# Altium schematic sheet 03_POWER.SchDoc: =TitleParameter
size A3; SPICEModelCacheDAYWLYRY: <root> / <DocumentId>DAYWLYRY</DocumentId> / </root>; Organization: ASISGUARD; Address1: Kemalpasa, Kemalpasa Cd. No:290 D:292H, 35060 Bornova/Izmir/Turkey; SheetNumber: 3; SheetTotal: 12
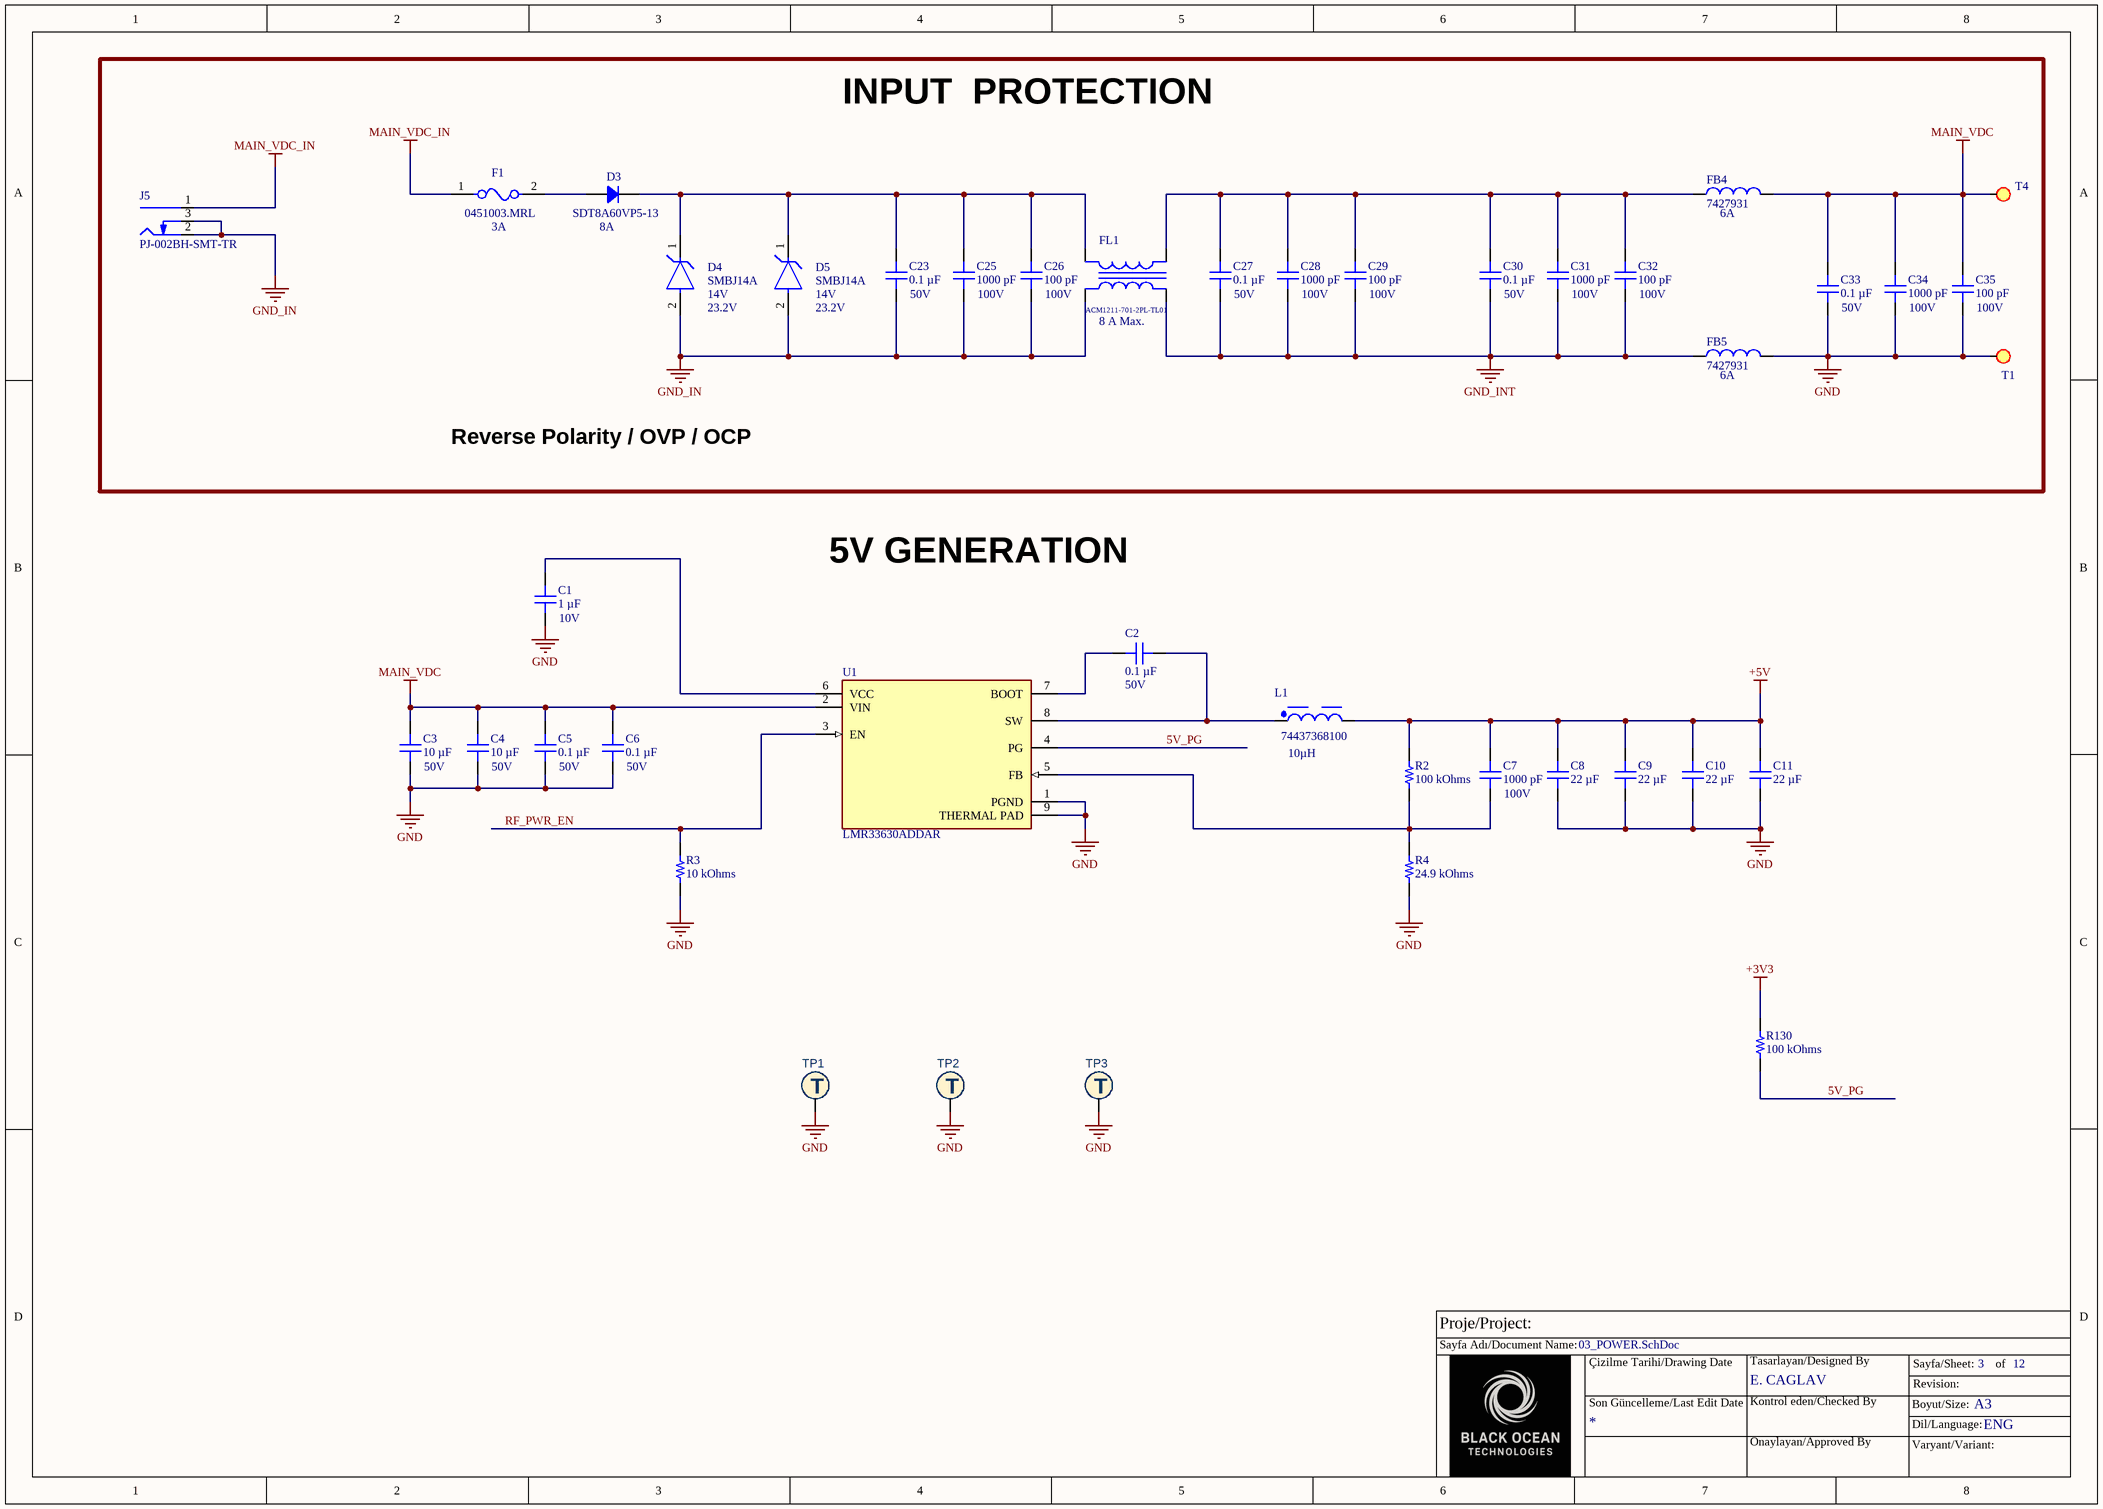
[diagram p0: 03_POWER.SchDoc]

## Parts
C1  Voltage - Rated: 10V  [MURATA GRM155 0402_1005]  (hidden comment: 1 µF)
C2  Voltage - Rated: 50V  [CAP 0402_1005]  (hidden comment: 0.1 µF)
C3  Voltage - Rated: 50V  [CAP 1206_3216 - 0.8MM]  (hidden comment: 10 µF)
C4  Voltage - Rated: 50V  [CAP 1206_3216 - 0.8MM]  (hidden comment: 10 µF)
C5  Voltage - Rated: 50V  [CAP 0402_1005]  (hidden comment: 0.1 µF)
C6  Voltage - Rated: 50V  [CAP 0402_1005]  (hidden comment: 0.1 µF)
C7  Voltage - Rated: 100V  [CAP 0402_1005]  (hidden comment: 1000 pF)
C8  22 µF  [CAP 0805_2012]
C9  22 µF  [CAP 0805_2012]
C10  22 µF  [CAP 0805_2012]
C11  22 µF  [CAP 0805_2012]
C23  Voltage - Rated: 50V  [CAP 0402_1005]  (hidden comment: 0.1 µF)
C25  Voltage - Rated: 100V  [CAP 0402_1005]  (hidden comment: 1000 pF)
C26  Voltage - Rated: 100V  [CAP 0402_1005]  (hidden comment: 100 pF)
C27  Voltage - Rated: 50V  [CAP 0402_1005]  (hidden comment: 0.1 µF)
C28  Voltage - Rated: 100V  [CAP 0402_1005]  (hidden comment: 1000 pF)
C29  Voltage - Rated: 100V  [CAP 0402_1005]  (hidden comment: 100 pF)
C30  Voltage - Rated: 50V  [CAP 0402_1005]  (hidden comment: 0.1 µF)
C31  Voltage - Rated: 100V  [CAP 0402_1005]  (hidden comment: 1000 pF)
C32  Voltage - Rated: 100V  [CAP 0402_1005]  (hidden comment: 100 pF)
C33  Voltage - Rated: 50V  [CAP 0402_1005]  (hidden comment: 0.1 µF)
C34  Voltage - Rated: 100V  [CAP 0402_1005]  (hidden comment: 1000 pF)
C35  Voltage - Rated: 100V  [CAP 0402_1005]  (hidden comment: 100 pF)
D3  SDT8A60VP5-13  Current - Average Rectified (Io): 8A  [DIODES INC SDT10A45P5]
D4  SMBJ14A  Reverse Standoff Voltage: 14V  Clamping Voltage: 23.2V  [FP-SMBJ-MFG]
D5  SMBJ14A  Reverse Standoff Voltage: 14V  Clamping Voltage: 23.2V  [FP-SMBJ-MFG]
F1  0451003.MRL  Fuse Current: 3A  [FP-0451-MFG]
FB4  7427931  Current Rating: 6A  [WE-PBF_8530_L9.5W3H3.1]
FB5  7427931  Current Rating: 6A  [WE-PBF_8530_L9.5W3H3.1]
FL1  ACM1211-701-2PL-TL01  Rated Current: 8 A Max.  [TDK-ACM1211-4_V]
J5  PJ-002BH-SMT-TR  [CUI PJ-002BH-SMT-TR]
L1  74437368100  Inductance: 10µH  [WE-LHMI_1040]
R2  100 kOhms  [RES 0402_1005]
R3  10 kOhms  [RES 0402_1005]
R4  24.9 kOhms  [RES 0402_1005]
R130  100 kOhms  [RES 0402_1005]
T1  SMD  [TEST_POINT_SMD]  (value not drawn)
T4  SMD  [TEST_POINT_SMD]  (value not drawn)
TP1  5018  [5018_KEYSTONE]  (value not drawn)
TP2  5018  [5018_KEYSTONE]  (value not drawn)
TP3  5018  [5018_KEYSTONE]  (value not drawn)
U1  LMR33630ADDAR  [FP-DDA0008J-MFG]

## Blocks framed on the sheet
INPUT  PROTECTION: C23 C25-C35 D3-D5 F1 FB4 FB5 FL1 J5 T1 T4

## Nets
+3V3: R130.2
+5V: C7.2 C8.2 C9.2 C10.2 C11.2 L1.2 R2.2
GND: C1.2 C3.1 C4.1 C5.1 C6.1 C8.1 C9.1 C10.1 C11.1 C33.1 C34.1 C35.1 FB5.2 R3.1 R4.1 T1.1(TP) TP1.1 TP2.1 TP3.1 U1.1(PGND) U1.9(THERMAL_PAD)
GND_IN: C23.1 C25.1 C26.1 D4.2(A) D5.2(A) FL1.1 J5.2(Outer) J5.3(SW)
GND_INT: C27.1 C28.1 C29.1 C30.1 C31.1 C32.1 FB5.1 FL1.4
MAIN_VDC: C3.2 C4.2 C5.2 C6.2 C33.2 C34.2 C35.2 FB4.2 T4.1(TP) U1.2(VIN)
MAIN_VDC_IN: F1.1 J5.1(Centre)
5V_PG: R130.1 U1.4(PG)
RF_PWR_EN: R3.2 U1.3(EN)
NetC1_1: C1.1 U1.6(VCC)
NetC2_1: C2.1 L1.1 U1.8(SW)
NetC2_2: C2.2 U1.7(BOOT)
NetC7_1: C7.1 R2.1 R4.2 U1.5(FB)
NetC23_2: C23.2 C25.2 C26.2 D3.1 D4.1(C) D5.1(C) FL1.2
NetC27_2: C27.2 C28.2 C29.2 C30.2 C31.2 C32.2 FB4.1 FL1.3
NetD3_2: D3.2 F1.2

## Notes on the sheet
- Reverse Polarity / OVP / OCP
- 5V GENERATION
- Proje/Project:
- Sayfa Adı/Document Name:
- Çizilme Tarihi/Drawing Date
- E. CAGLAV
- Tasarlayan/Designed By
- Sayfa/Sheet:
- Revision:
- of
- Son Güncelleme/Last Edit Date
- Kontrol eden/Checked By
- Onaylayan/Approved By
- Boyut/Size:
- Varyant/Variant:
- Dil/Language:
- A3
- ENG
- (in symbol 5018) T

## Library data of the parts
C1 = GRM155C71A105KE11D: CAP CER 1UF 10V X7S 0402; manufacturer: Murata Electronics; Tolerance: ±10%; Part Number: GRM155C71A105KE11D; Capacitance: 1 µF; Applications: General Purpose; componentlink1description: Datasheet; componentlink1url: https://search.murata.co.jp/Ceramy/image/img/A01X/G101/ENG/GRM155C71A105KE11-01.pdf; componentlink2description: DigiKey Link; componentlink2url: https://www.digikey.com/en/products/detail/murata-electronics/GRM155C71A105KE11D/6606086; Device Package: 0402 (1005 Metric); lastupdated: 23.07.2025 10:42:36; Lifecycle Status: Active; Minimum Order: 1; Mounting Type: Surface Mount, MLCC; Operating Temperature: -55°C ~ 125°C; Package / Case: 0402 (1005 Metric); packaging: TapeAndReel; partid: 1749; Part Status: Active; price: 0.01; series: GRM; Size / Dimension: 0.039" L x 0.020" W (1.00mm x 0.50mm); Supplier 1: DigiKey; Supplier Part Number 1: 490-14457-1-ND; Temperature Coefficient: X7S; Thickness (Max): 0.024" (0.60mm); value: 1 µF
C2 C5 C6 C23 C27 C30 C33 = GCM155R71H104KE02J: CAP CER 0.1UF 50V X7R 0402; manufacturer: Murata Electronics; Tolerance: ±10%; Part Number: GCM155R71H104KE02J; Capacitance: 0.1 µF; Applications: Automotive; componentlink1description: Datasheet; componentlink1url: https://search.murata.co.jp/Ceramy/image/img/A01X/G101/ENG/GCM155R71H104KE02-01.pdf; componentlink2description: DigiKey Link; componentlink2url: https://www.digikey.com/en/products/detail/murata-electronics/GCM155R71H104KE02J/4903705; Device Package: 0402 (1005 Metric); lastupdated: 4/6/2026 7:10:30 PM; Lifecycle Status: Active; Minimum Order: 1; Mounting Type: Surface Mount, MLCC; Operating Temperature: -55°C ~ 125°C; Package / Case: 0402 (1005 Metric); packaging: TapeAndReel; partid: 11356; Part Status: Active; price: 0.01; Ratings: AEC-Q200; series: GCM; Size / Dimension: 0.039" L x 0.020" W (1.00mm x 0.50mm); Supplier 1: DigiKey; Supplier Part Number 1: 490-14514-1-ND; Temperature Coefficient: X7R; Thickness (Max): 0.022" (0.55mm); value: 0.1 µF
C3 C4 = CL31B106KBHNNNE: CAP CER 10UF 50V X7R 1206; manufacturer: Samsung Electro-Mechanics; Tolerance: ±10%; Part Number: CL31B106KBHNNNE; Capacitance: 10 µF; Applications: General Purpose; componentlink1description: Datasheet; componentlink1url: http://www.samsungsem.com/kr/support/product-search/mlcc/CL31B106KBHNNNE.jsp; componentlink2description: DigiKey Link; componentlink2url: https://www.digikey.com/en/products/detail/samsung-electro-mechanics/CL31B106KBHNNNE/5961251; Device Package: 1206 (3216 Metric); lastupdated: 4/6/2026 7:38:00 PM; Lifecycle Status: Active; Minimum Order: 1; Mounting Type: Surface Mount, MLCC; Operating Temperature: -55°C ~ 125°C; Package / Case: 1206 (3216 Metric); packaging: TapeAndReel; partid: 40563; Part Status: Active; price: 0.06; series: CL; Size / Dimension: 0.126" L x 0.063" W (3.20mm x 1.60mm); Supplier 1: DigiKey; Supplier Part Number 1: 1276-6767-1-ND; Temperature Coefficient: X7R; Thickness (Max): 0.071" (1.80mm); value: 10 µF
C7 C25 C28 C31 C34 = C0402H102J1GAC7867: CAP CER 1000PF 100V C0G/NP0 0402; manufacturer: KEMET; Temperature Coefficient: C0G, NP0; Tolerance: ±5%; Part Number: C0402H102J1GAC7867; Capacitance: 1000 pF; Applications: Downhole; componentlink1description: Datasheet; componentlink1url: https://api.kemet.com/component-edge/download/datasheet/C0402H102J1GAC7867.pdf; componentlink2description: DigiKey Link; componentlink2url: https://www.digikey.com/en/products/detail/kemet/C0402H102J1GAC7867/5267578; Device Package: 0402 (1005 Metric); Features: Low ESL, High Temperature; lastupdated: 3/30/2026 7:10:31 PM; Lifecycle Status: Active; Minimum Order: 1; Mounting Type: Surface Mount, MLCC; Operating Temperature: -55°C ~ 200°C; Package / Case: 0402 (1005 Metric); packaging: TapeAndReel; partid: 3822; Part Status: Active; price: 0.24; series: SMD Indust C0G HT200C; Size / Dimension: 0.039" L x 0.020" W (1.00mm x 0.50mm); Supplier 1: DigiKey; Supplier Part Number 1: 399-11931-1-ND; Thickness (Max): 0.022" (0.55mm); value: 1000 pF
C8-C11 = CL21A226KOQNNNE: CAP CER 22UF 16V X5R 0805; manufacturer: Samsung Electro-Mechanics; Tolerance: ±10%; Part Number: CL21A226KOQNNNE; Capacitance: 22 µF; Applications: General Purpose; componentlink1description: Datasheet; componentlink1url: http://www.samsungsem.com/kr/support/library/product-catalog/mlcc.jsp; componentlink2description: DigiKey Link; componentlink2url: https://www.digikey.com/en/products/detail/samsung-electro-mechanics/CL21A226KOQNNNE/5961010; Device Package: 0805 (2012 Metric); lastupdated: 4/6/2026 7:33:17 PM; Lifecycle Status: Active; Minimum Order: 1; Mounting Type: Surface Mount, MLCC; Operating Temperature: -55°C ~ 85°C; Package / Case: 0805 (2012 Metric); packaging: TapeAndReel; partid: 3004; Part Status: Active; price: 0.06; series: CL; Size / Dimension: 0.079" L x 0.049" W (2.00mm x 1.25mm); Supplier 1: DigiKey; Supplier Part Number 1: 1276-6526-1-ND; Temperature Coefficient: X5R; Thickness (Max): 0.055" (1.40mm); value: 22 µF; Voltage - Rated: 16V
C26 C29 C32 C35 = CC0402JRNPO0BN101: CAP CER 100PF 100V C0G/NPO 0402; manufacturer: Yageo; Temperature Coefficient: C0G, NP0; Tolerance: ±5%; Part Number: CC0402JRNPO0BN101; Capacitance: 100 pF; Applications: General Purpose; componentlink1description: Datasheet; componentlink1url: https://www.yageo.com/upload/media/product/productsearch/datasheet/mlcc/UPY-NP0X7R_MV_100-to-630V_24.pdf; componentlink2description: DigiKey Link; componentlink2url: https://www.digikey.com/en/products/detail/yageo/CC0402JRNPO0BN101/11490291; Device Package: 0402 (1005 Metric); lastupdated: 4/6/2026 7:09:54 PM; Lifecycle Status: Active; Minimum Order: 1; Mounting Type: Surface Mount, MLCC; Operating Temperature: -55°C ~ 125°C; Package / Case: 0402 (1005 Metric); packaging: TapeAndReel; partid: 44692; Part Status: Active; price: 0.01; series: CC; Size / Dimension: 0.039" L x 0.020" W (1.00mm x 0.50mm); Supplier 1: DigiKey; Supplier Part Number 1: 13-CC0402JRNPO0BN101CT-ND; Thickness (Max): 0.022" (0.55mm); value: 100 pF
D3 = SDT8A60VP5-13: DIODE SCHOTTKY 60V 8A PWRDI5 5K; Manufacturer: Diodes Incorporated; Current - Reverse Leakage @ Vr: 200 µA @ 60 V; Speed: Fast Recovery =< 500ns, > 200mA (Io); Voltage - Forward (Vf) (Max) @ If: 540 mV @ 8 A; Part Number: SDT8A60VP5-13; ComponentLink1Description: Datasheet; ComponentLink1URL: https://www.diodes.com/assets/Datasheets/SDT8A60VP5.pdf; ComponentLink2Description: DigiKey Link; ComponentLink2URL: https://www.digikey.com/en/products/detail/diodes-incorporated/SDT8A60VP5-13/16547989; LastUpdated: 4/5/2026 9:26:18 PM; Lifecycle Status: Active; Minimum Order: 1; Mounting Type: Surface Mount; Operating Temperature - Junction: -55°C ~ 150°C; Packaging: TapeAndReel; PartId: 3631; Price: 0.12; Series: -; Supplier 1: DigiKey; Supplier Part Number 1: 31-SDT8A60VP5-13CT-ND; Supplier Device Package: PowerDI™ 5; Voltage - DC Reverse (Vr) (Max): 60 V
D4 D5 = CMP-15642-000001-1: TVS DIODE 14V 23.2V DO214AA; Manufacturer: Taiwan Semiconductor Corporation; Standoff Height: 0.05mm; Direction: Unidirectional; Max Junction Temp: +150°C; Peak Pulse Current: 27A; Number Of Channels: 1; Peak Pulse Power: 600W; Breakdown Voltage: 15.6V; Octopart: https://octopart.com/smbj14a-taiwan+semiconductor-13998009; Package: SMBJ; Device Class L2: TVS Diodes; Height: 2.65mm; Temperature Range Low: -55°C; Category: Diode; Temperature Range High: +150°C; Lead Free: Yes; Temperature: -55°C to +150°C; RoHS: TRUE; Digikey Description: TVS DIODE 14V 23.2V DO214AA; Mouser Description: TVS Diodes - Transient Voltage Suppressors 14V 600W 5% Uni; ComponentLink2URL: https://www.taiwansemi.com/products/datasheet/SMBJ%20SERIES_P1812.pdf; Device Class L3: unset; Device Class L1: Circuit Protection; ComponentLink2Description: Datasheet; Manufacturer Part Number: SMBJ14A; Automotive: No
F1 = CMP-08605-000063-1: FUSE BRD MNT 3A 125VAC/VDC 2SMD; Manufacturer: Littelfuse Inc; Fuse Interrupt Ac Current: 50A; Voltage Rating: 125V; Fuse I2T: 1.65A2Sec; Resistance: 0.0227Ω; Fuse Blow Speed: Fast; Value: 0.0227Ω; RoHS: TRUE; Automotive: No; Max Fuse Dc Voltage: 125V; Mouser Description: Surface Mount Fuses 125V 3A; Package: 0451; Device Class L2: Fuses; Manufacturer Part Number: 0451003.MRL; ComponentLink2Description: Datasheet; Lead Free: Yes; Temperature Range Low: -55°C; Max Fuse Ac Voltage: 125V; Temperature: -55°C to +125°C; Device Class L1: Circuit Protection; Octopart: https://octopart.com/0451003.mrl-littelfuse-566380; Category: Fuse; Height: 2.94mm; Temperature Range High: +125°C; ComponentLink2URL: https://www.littelfuse.com/~/media/electronics/datasheets/fuses/littelfuse_fuse_451_453_datasheet.pdf.pdf; Digikey Description: FUSE BRD MNT 3A 125VAC/VDC 2SMD; Device Class L3: unset; Fuse Interrupt Dc Current: 50A
FB4 FB5 = CMP-0220-00052-2: NexarPartId: 19122445; Tolerance: 25%; Number of Lines: 1; Test Frequency: 100MHz; Shielding: Unshielded; Impedance: 91Ω; DC Resistance (DCR): 900µΩ; Min Operating Temperature: -55°C; Mount: Surface Mount; Length: 8.5mm; Depth: 3mm; Case Code (Metric): 3225; REACH SVHC: Unknown; Max Current Rating: 6A; Max Operating Temperature: 125°C; Case/Package: SMD/SMT; Case Code (Imperial): 1210; RoHS: Compliant; Height: 2.55mm; Packaging: Cut Tape (CT); Width: 3mm; Termination: SMD/SMT; Max DC Current: 6A
FL1 = CMP-1342-00001-1: Common Mode Filter, 700 Ohm Impedance, 8 A, 80 V, -40 to 85 degC, 4-Pin 12 x 11 x 6 mm SMD, RoHS, Reel; Manufacturer: TDK; DCR: 6 mOhm Max.; Insulation resistance: 10 M Ohm Min.; Rated Voltage: 80 A Max.; Impedance@100 MHz: 700 Ohm Typ.; Packing: Reel; ComponentLink3URL: http://product.tdk.com/en/catalog/datasheets/e9713_acm.pdf; RoHS: TRUE; DatasheetVersion: Jul-14; PartNumber: ACM1211-701-2PL-TL01; ComponentLink2URL: http://product.tdk.com/en/catalog/datasheets/e9713_acm.pdf; ComponentLink2Description: Datasheet; Mounting Technology: Surface Mount; Temperature Range: -40 to 85 degC; ComponentLink1URL: http://www.global.tdk.com/; PackageDescription: 4-Pin Surface Mount Device, Body 12 x 11 mm, Pitch 5.2 mm; ComponentLink3Description: Package Specification; ComponentLink1Description: Manufacturer URL
J5 = PJ-002BH-SMT-TR: CONN PWR JACK 2.5X5.5MM SOLDER; Manufacturer: CUI Devices; Actual Diameter: 0.098" (2.50mm ID), 0.256" (6.50mm OD); Current Rating (Amps): 5A; Gender: Male; Industry Recognized Mating Diameter: 2.50mm ID (0.098"), 5.50mm OD (0.217"); Internal Switch(s): Single Switch, Normally Closed; Material Flammability Rating: UL94 V-0; Mating Length/Depth: 0.350" (8.90mm); Number of Positions/Contacts: 2 Conductors, 3 Contacts; Shielding: Unshielded; Voltage - Rated: 24VDC; Part Number: PJ-002BH-SMT-TR; ComponentLink1Description: Datasheet; ComponentLink1URL: https://www.cuidevices.com/product/resource/digikeypdf/pj-002bh-smt-tr.pdf; ComponentLink2Description: DigiKey Link; ComponentLink2URL: http://digikey.com/product-detail/en/cui-devices/PJ-002BH-SMT-TR/CP-002BHPJCT-ND/669694; Connector Type: Jack; Features: Board Guide, Solder Retention; LastUpdated: 5/26/2020 1:34:08 PM; Lifecycle Status: Active; Minimum Order: 1; Mounting Type: Surface Mount, Right Angle; Packaging: TapeAndReel; Part Status: Active; Price: 0.90; Series: -; Supplier 1: DigiKey; Supplier Part Number 1: CP-002BHPJCT-ND; Termination: Solder
L1 = CMP-1353-00006-7: We-lhmi; 10000NH; Composite Iron Multilayer SMD Induc., 1040 Case; .012GHZ 5.2A; Self Resonant Frequency: 12MHz; Test Frequency: 100kHz; Inductance Tolerance: 20%; Shielding: Shielded; DC Resistance (DCR): 27mΩ; Series Resistance: 30mΩ; Core Material: Composite, Ferrite; Saturation Current: 7.9A; Case/Package: Nonstandard; Ambient Temperature Range Low: -40°C; Height - Seated (Max): 3.9878mm; Max Operating Temperature: 125°C; REACH SVHC: Unknown; Height: 3.8mm; Mount: Surface Mount; Termination: SMD/SMT; Current Rating: 5.2A; Width: 10mm; Frequency: 12MHz; Max DC Current: 5.2A; Composition: Wirewound; Tolerance: 20%; Min Operating Temperature: -40°C; RoHS: Compliant; Length: 11mm; RMS Current (Irms): 5.2A; Depth: 10mm; Ambient Temperature Range High: 85°C
R2 = RC0402FR-13100KL: RES 100K OHM 1% 1/16W 0402; Manufacturer: Yageo; Power (Watts): 0.063W, 1/16W; Temperature Coefficient: ±100ppm/°C; Part Number: RC0402FR-13100KL; Value: 100 kOhms; ComponentLink1Description: Datasheet; ComponentLink1URL: https://www.yageo.com/upload/media/product/productsearch/datasheet/rchip/PYu-RC_Group_51_RoHS_L_11.pdf; ComponentLink2Description: DigiKey Link; ComponentLink2URL: https://www.digikey.com/en/products/detail/yageo/RC0402FR-13100KL/13546624; Composition: Thick Film; Device Package: 0402 (1005 Metric); Features: Moisture Resistant; Height - Seated (Max): 0.016" (0.40mm); LastUpdated: 4/6/2026 7:40:59 PM; Lifecycle Status: Active; Minimum Order: 1; Number of Terminations: 2; Operating Temperature: -55°C ~ 155°C; Package / Case: 0402 (1005 Metric); Packaging: CutTape; PartId: 59069; Part Status: Active; Price: 0.01; Resistance: 100 kOhms; Series: RC_L; Size / Dimension: 0.039" L x 0.020" W (1.00mm x 0.50mm); Supplier 1: DigiKey; Supplier Part Number 1: 13-RC0402FR-13100KLCT-ND; Supplier Device Package: 0402; Tolerance: ±1%
R3 = RC0402FR-0710KL: RES 10K OHM 1% 1/16W 0402; Manufacturer: Yageo; Power (Watts): 0.063W, 1/16W; Temperature Coefficient: ±100ppm/°C; Part Number: RC0402FR-0710KL; Value: 10 kOhms; ComponentLink1Description: Datasheet; ComponentLink1URL: https://www.yageo.com/upload/media/product/productsearch/datasheet/rchip/PYu-RC_Group_51_RoHS_L_10.pdf; ComponentLink2Description: DigiKey Link; ComponentLink2URL: https://www.digikey.com/en/products/detail/yageo/RC0402FR-0710KL/726523; Composition: Thick Film; Device Package: 0402 (1005 Metric); Features: Moisture Resistant; Height - Seated (Max): 0.016" (0.40mm); LastUpdated: 4/6/2026 7:41:07 PM; Lifecycle Status: Active; Minimum Order: 1; Number of Terminations: 2; Operating Temperature: -55°C ~ 155°C; Package / Case: 0402 (1005 Metric); Packaging: CutTape; PartId: 17593; Part Status: Active; Price: 0.01; Resistance: 10 kOhms; Series: RC_L; Size / Dimension: 0.039" L x 0.020" W (1.00mm x 0.50mm); Supplier 1: DigiKey; Supplier Part Number 1: 311-10.0KLRCT-ND; Supplier Device Package: 0402; Tolerance: ±1%
R4 = RC0402FR-0724K9L: RES 24.9K OHM 1% 1/16W 0402; Manufacturer: Yageo; Power (Watts): 0.063W, 1/16W; Temperature Coefficient: ±100ppm/°C; Part Number: RC0402FR-0724K9L; Value: 24.9 kOhms; ComponentLink1Description: Datasheet; ComponentLink1URL: https://www.yageo.com/upload/media/product/productsearch/datasheet/rchip/PYu-RC_Group_51_RoHS_L_10.pdf; ComponentLink2Description: DigiKey Link; ComponentLink2URL: https://www.digikey.com/en/products/detail/yageo/RC0402FR-0724K9L/726567; Composition: Thick Film; Device Package: 0402 (1005 Metric); Features: Moisture Resistant; Height - Seated (Max): 0.016" (0.40mm); LastUpdated: 4/6/2026 7:41:07 PM; Lifecycle Status: Active; Minimum Order: 1; Number of Terminations: 2; Operating Temperature: -55°C ~ 155°C; Package / Case: 0402 (1005 Metric); Packaging: CutTape; PartId: 17908; Part Status: Active; Price: 0.01; Resistance: 24.9 kOhms; Series: RC_L; Size / Dimension: 0.039" L x 0.020" W (1.00mm x 0.50mm); Supplier 1: DigiKey; Supplier Part Number 1: 311-24.9KLRCT-ND; Supplier Device Package: 0402; Tolerance: ±1%
R130 = AC0402FR-07100KL: RES SMD 100K OHM 1% 1/16W 0402; Manufacturer: Yageo; Power (Watts): 0.063W, 1/16W; Temperature Coefficient: ±100ppm/°C; Part Number: AC0402FR-07100KL; Value: 100 kOhms; ComponentLink1Description: Datasheet; ComponentLink1URL: https://www.yageo.com/upload/media/product/productsearch/datasheet/rchip/PYu-AC_51_RoHS_L_7.pdf; ComponentLink2Description: DigiKey Link; ComponentLink2URL: https://www.digikey.com/en/products/detail/yageo/AC0402FR-07100KL/5895021; Composition: Thick Film; Device Package: 0402 (1005 Metric); Features: Automotive AEC-Q200, Moisture Resistant; Height - Seated (Max): 0.015" (0.37mm); LastUpdated: 4/6/2026 7:41:12 PM; Lifecycle Status: Active; Minimum Order: 1; Number of Terminations: 2; Operating Temperature: -55°C ~ 155°C; Package / Case: 0402 (1005 Metric); Packaging: CutTape; PartId: 12047; Part Status: Active; Price: 0.01; Ratings: AEC-Q200; Resistance: 100 kOhms; Series: AC; Size / Dimension: 0.039" L x 0.020" W (1.00mm x 0.50mm); Supplier 1: DigiKey; Supplier Part Number 1: YAG3434CT-ND; Supplier Device Package: 0402; Tolerance: ±1%
T1 T4 = TP: DESIG: testing PAD; FAB: NA; VAL: NOT POPULATED; PCB Footprint: test0_8-smd; REF: NA
TP1-TP3 = 5018: MECH PC TEST POINT COMPACT; Manufacturer 1: KEYSTONE; SAP: 1029058; Location: NA; MSL Level: Level-1; MaxHeight_mm: 2.29; M_Number_of_Pins: 1; Check: Approved; Manufacturer Part Number 1: 5018; UnitPrice: 0.38; Status: Active; PackageType: SMD; Value: 5018; Package: 5018; ComponentLink1Description: Digikey; ComponentLink1URL: https://www.digikey.com/en/products/detail/keystone-electronics/5018/1979204; ComponentLink2Description: Datasheet; ComponentLink2URL: D:\SAVRONIK_SVN\Donanım\trunk\ALTIUM\Central Library\Datasheets\Mechanical\5018_Datasheet.pdf; Supplier 1: Digikey; Supplier Part Number 1: 36-5018TR-ND
U1 = CMP-04918-000184-1: IC REG BUCK ADJUSTABLE 3A 8SOPWR; Switching Frequency: 400kHz; Number of Outputs: 1; Output Configuration: Positive; Synchronous Rectifier: Yes; Min Output Voltage: 1V; Max Output Voltage: 24V; Max Input Voltage: 36V; Min Input Voltage: 3.8V; Output Current: 3A; Min Operating Temperature: -40°C; Max Operating Temperature: 125°C; Number of Pins: 8; RoHS Compliant: Yes; Mount: Surface Mount; Output Type: Adjustable; Packaging: Cut Tape